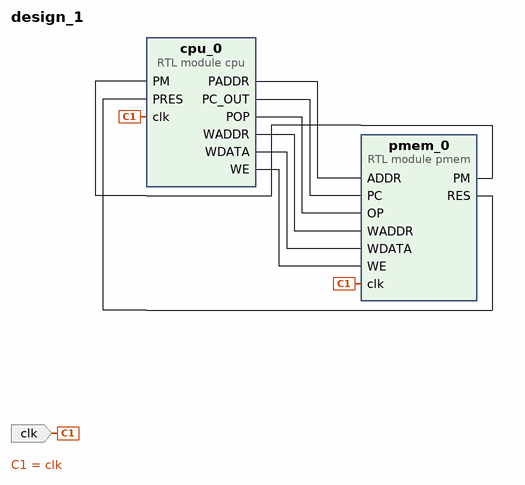
[diagram p0: block diagram of the top level]
# Vivado block design design_1, xc7z020clg400-1, Vivado 2022.1
create_bd_design design_1

create_bd_port -dir I clk

create_bd_cell -type module -reference pmem pmem_0
create_bd_cell -type module -reference cpu cpu_0

# ---- connections ----

connect_bd_net [get_bd_ports clk] [get_bd_pins pmem_0/clk] [get_bd_pins cpu_0/clk]
connect_bd_net [get_bd_pins cpu_0/PADDR] [get_bd_pins pmem_0/ADDR]
connect_bd_net -net cpu_0_PC [get_bd_pins cpu_0/PC_OUT] [get_bd_pins pmem_0/PC]
connect_bd_net [get_bd_pins cpu_0/POP] [get_bd_pins pmem_0/OP]
connect_bd_net [get_bd_pins cpu_0/WADDR] [get_bd_pins pmem_0/WADDR]
connect_bd_net [get_bd_pins cpu_0/WDATA] [get_bd_pins pmem_0/WDATA]
connect_bd_net [get_bd_pins cpu_0/WE] [get_bd_pins pmem_0/WE]
connect_bd_net -net pmem_0_PCOUT [get_bd_pins pmem_0/PM] [get_bd_pins cpu_0/PM]
connect_bd_net [get_bd_pins pmem_0/RES] [get_bd_pins cpu_0/PRES]

validate_bd_design
save_bd_design
